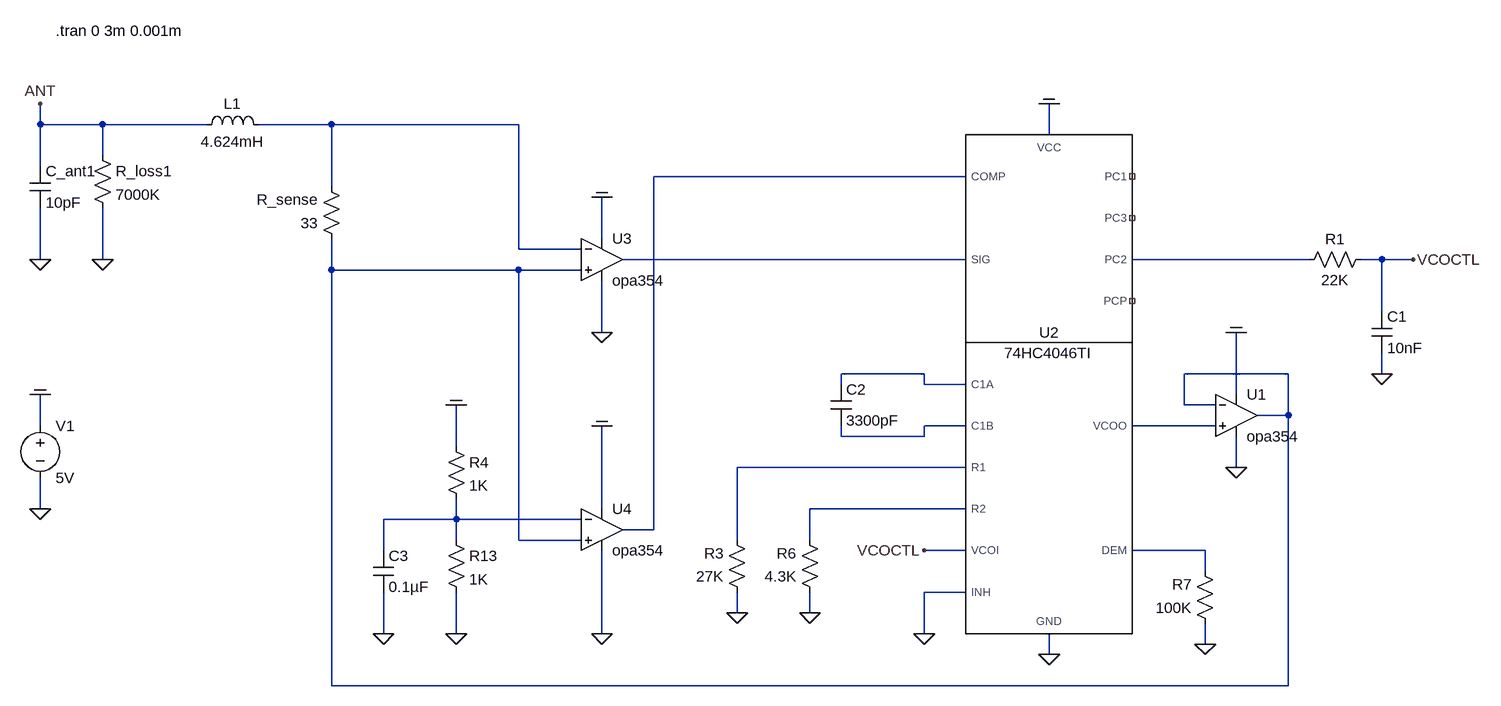
[diagram p0: schematic 2020_pll_4046_v01.asc]
2020_pll_4046_v01.asc, the LTspice schematic file:
Version 4
SHEET 1 2660 900
WIRE -448 -544 -448 -576
WIRE -352 -544 -448 -544
WIRE -192 -544 -352 -544
WIRE 0 -544 -112 -544
WIRE 288 -544 0 -544
WIRE 1104 -528 1104 -576
WIRE -352 -496 -352 -544
WIRE -448 -480 -448 -544
WIRE 976 -464 496 -464
WIRE 0 -448 0 -544
WIRE 416 -368 416 -432
WIRE 288 -352 288 -544
WIRE 384 -352 288 -352
WIRE -448 -336 -448 -416
WIRE -352 -336 -352 -416
WIRE 976 -336 448 -336
WIRE 1504 -336 1232 -336
WIRE 1616 -336 1584 -336
WIRE 1664 -336 1616 -336
WIRE 0 -320 0 -368
WIRE 288 -320 0 -320
WIRE 384 -320 288 -320
WIRE 1616 -256 1616 -336
WIRE 416 -224 416 -304
WIRE 912 -160 784 -160
WIRE 1472 -160 1312 -160
WIRE 1616 -160 1616 -192
WIRE 784 -144 784 -160
WIRE 912 -144 912 -160
WIRE 976 -144 912 -144
WIRE 1392 -128 1392 -224
WIRE 1312 -112 1312 -160
WIRE 1360 -112 1312 -112
WIRE 1472 -96 1472 -160
WIRE 1472 -96 1424 -96
WIRE -448 -80 -448 -128
WIRE 976 -80 912 -80
WIRE 1360 -80 1232 -80
WIRE 784 -64 784 -80
WIRE 912 -64 912 -80
WIRE 912 -64 784 -64
WIRE 192 -48 192 -112
WIRE 976 -16 624 -16
WIRE 1392 -16 1392 -64
WIRE -448 48 -448 0
WIRE 416 48 416 -80
WIRE 976 48 736 48
WIRE 192 64 192 32
WIRE 192 64 80 64
WIRE 384 64 192 64
WIRE 496 80 496 -464
WIRE 496 80 448 80
WIRE 192 96 192 64
WIRE 288 96 288 -320
WIRE 384 96 288 96
WIRE 624 96 624 -16
WIRE 736 96 736 48
WIRE 80 112 80 64
WIRE 976 112 912 112
WIRE 1344 112 1232 112
WIRE 1344 144 1344 112
WIRE 976 176 912 176
WIRE 624 208 624 176
WIRE 736 208 736 176
WIRE 80 240 80 176
WIRE 192 240 192 176
WIRE 416 240 416 112
WIRE 912 240 912 176
WIRE 1344 256 1344 224
WIRE 1104 272 1104 240
WIRE 0 320 0 -320
WIRE 1472 320 1472 -96
WIRE 1472 320 0 320
FLAG -448 -128 COM
FLAG -448 48 0
FLAG 1104 272 0
FLAG 1104 -576 COM
FLAG 624 208 0
FLAG 736 208 0
FLAG 1344 256 0
FLAG 912 240 0
FLAG -448 -336 0
FLAG -448 -576 ANT
FLAG -352 -336 0
FLAG 416 -432 COM
FLAG 416 -224 0
FLAG 416 -80 COM
FLAG 416 240 0
FLAG 80 240 0
FLAG 1616 -160 0
FLAG 1664 -336 VCOCTL
FLAG 912 112 VCOCTL
FLAG 1392 -224 COM
FLAG 1392 -16 0
FLAG 192 240 0
FLAG 192 -112 COM
SYMBOL voltage -448 -96 R0
WINDOW 123 0 0 Left 0
WINDOW 39 0 0 Left 0
SYMATTR InstName V1
SYMATTR Value 5V
SYMBOL res 640 192 R180
WINDOW 0 36 76 Left 2
WINDOW 3 36 40 Left 2
SYMATTR InstName R3
SYMATTR Value 27K
SYMBOL res 752 192 R180
WINDOW 0 36 76 Left 2
WINDOW 3 36 40 Left 2
SYMATTR InstName R6
SYMATTR Value 4.3K
SYMBOL cap 768 -144 R0
SYMATTR InstName C2
SYMATTR Value 3300pF
SYMBOL res 1360 240 R180
WINDOW 0 36 76 Left 2
WINDOW 3 36 40 Left 2
SYMATTR InstName R7
SYMATTR Value 100K
SYMBOL 74HC4046TI 1104 -400 R0
SYMATTR InstName U2
SYMBOL ind -208 -528 R270
WINDOW 0 32 56 VTop 2
WINDOW 3 5 56 VBottom 2
SYMATTR InstName L1
SYMATTR Value 4.624mH
SYMATTR SpiceLine Rser=120 Rpar=10Meg Cpar=1.216pF
SYMBOL cap -464 -480 R0
SYMATTR InstName C_ant1
SYMATTR Value 10pF
SYMBOL res -368 -512 R0
SYMATTR InstName R_loss1
SYMATTR Value 7000K
SYMBOL res 16 -352 R180
WINDOW 0 36 76 Left 2
WINDOW 3 36 40 Left 2
SYMATTR InstName R_sense
SYMATTR Value 33
SYMBOL res 176 80 R0
SYMATTR InstName R13
SYMATTR Value 1K
SYMBOL cap 64 112 R0
SYMATTR InstName C3
SYMATTR Value 0.1µF
SYMBOL res 1488 -320 R270
WINDOW 0 32 56 VTop 2
WINDOW 3 0 56 VBottom 2
SYMATTR InstName R1
SYMATTR Value 22K
SYMBOL cap 1600 -256 R0
SYMATTR InstName C1
SYMATTR Value 10nF
SYMBOL res 176 -64 R0
SYMATTR InstName R4
SYMATTR Value 1K
SYMBOL SBORKA\\OPamp\\opa354 416 -336 R0
SYMATTR InstName U3
SYMBOL SBORKA\\OPamp\\opa354 416 80 R0
SYMATTR InstName U4
SYMBOL SBORKA\\OPamp\\opa354 1392 -96 R0
SYMATTR InstName U1
TEXT -424 -688 Left 2 !.tran 0 3m 0.001m

The netlist it stands for:
* 2020_pll_4046_v01.asc
V1 COM 0 5V
R3 0 N009 27K
R6 0 N010 4.3K
C2 N006 N007 3300pF
R7 0 N012 100K
XU2 NC_01 NC_02 N002 N008 0 N006 N007 0 VCOCTL N012 N009 N010 N004 N003 NC_03 COM 74HC4046TI 74HC4046TI  ; pins PCP PC1 COMP VCOO INH C1A C1B GND VCOI DEM R1 R2 PC2 SIG PC3 VCC
L1 ANT N001 4.624mH Rser=120 Rpar=10Meg Cpar=1.216pF
C_ant1 ANT 0 10pF
R_loss1 ANT 0 7000K
R_sense N005 N001 33
R13 N011 0 1K
C3 N011 0 0.1µF
R1 N004 VCOCTL 22K
C1 VCOCTL 0 10nF
R4 COM N011 1K
* U3: opa354 (symbol SBORKA\OPamp\opa354 not available, pins judged from their places): In+=N005 In-=N001 V+=COM V-=0 OUT=N003
* U4: opa354 (symbol SBORKA\OPamp\opa354 not available, pins judged from their places): In+=N005 In-=N011 V+=COM V-=0 OUT=N002
* U1: opa354 (symbol SBORKA\OPamp\opa354 not available, pins judged from their places): In+=N008 In-=N005 V+=COM V-=0 OUT=N005
.tran 0 3m 0.001m
.lib 74HC4046.lib
.backanno
.end